# EasyEDA schematic SCH_Sherap_2021-11-23.json
TITLE: Arduino Shield Board; REV: 1.0; Date: 2021-10-27; Sheet: 1/1; Drawn By: Sherap; Company: Chitkara University
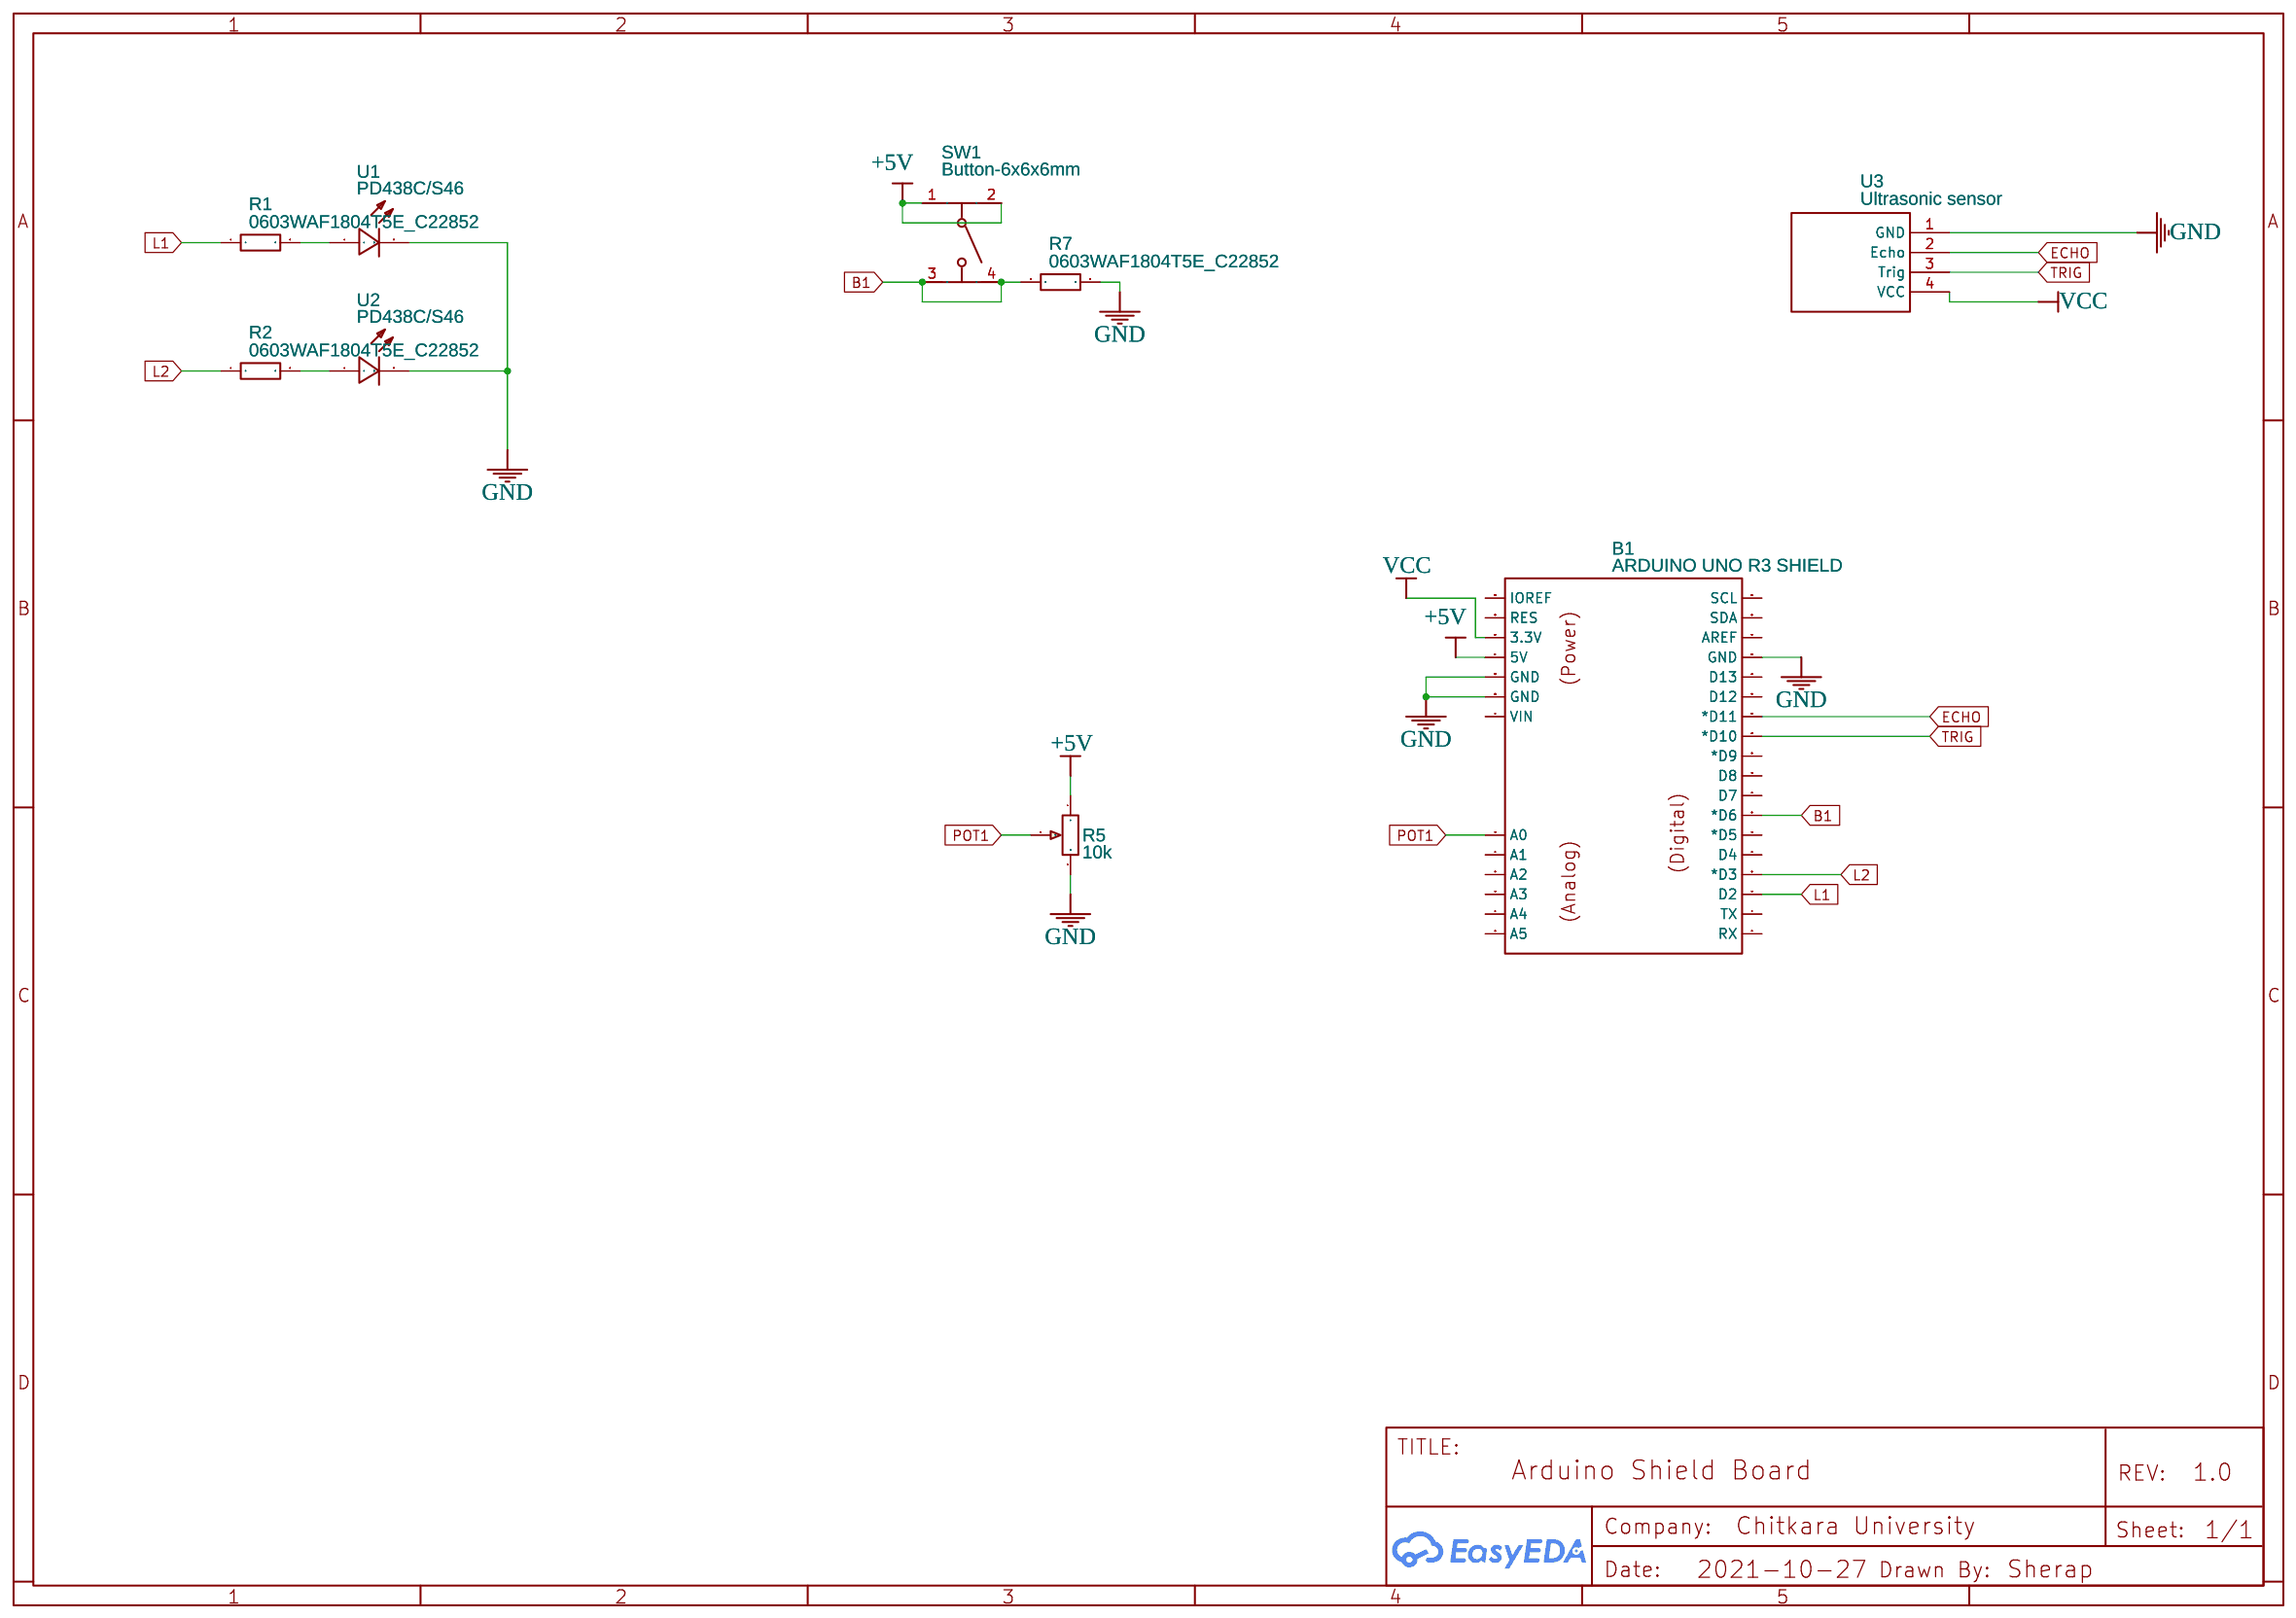
[diagram p0: schematic sheet]

## Parts
B1  ARDUINO UNO R3 SHIELD  [PKG-ARDUINO-UNO-R3-SHIELD]
R1  0603WAF1804T5E_C22852  [R0603]
R2  0603WAF1804T5E_C22852  [R0603]
R5  10k  [AS488DS3-SDF5]
R7  0603WAF1804T5E_C22852  [R0603]
SW1  Button-6x6x6mm  [SW-TH_4P-L6.0-W6.0-P4.50-LS6.1]
U1  PD438C/S46  [LED-TH_BD4.8-P2.54-FD]
U2  PD438C/S46  [LED-TH_BD4.8-P2.54-FD]
U3  Ultrasonic sensor  [ULTRASONIC SENSOR]

## Library data of the parts
B1 = ARDUINO UNO R3 SHIELD: Manufacturer: ?; Manufacturer Part: ?; Link: ?; Contributor: rgonzalez23
R1 R2 R7 = 0603WAF1804T5E_C22852: Supplier Part: C22852; Supplier: LCSC; Manufacturer: UniOhm; Manufacturer Part: 0603WAF1804T5E; JLCPCB Part Class: Extended Part
R5 = 3362F-1-103LF: Supplier: Digi-Key; Manufacturer: Panasonic Electronic Components; Supplier Part: 3362F-1-103LF-ND
SW1 = Button-6x6x6mm: Supplier Part: C71836; Supplier: LCSC; Manufacturer: BBJ; Manufacturer Part: Switch,6*6*6Plastic head,260G, 0.25mm,Straight line
U1 U2 = PD438C/S46: Supplier: LCSC; Manufacturer: EVERLIGHT; Contributor: LCSC; Supplier Part: C146238; JLCPCB Part Class: Extended Part
U3 = Ultrasonic sensor: Contributor: mohdazharsm

## Nets
+5V: B1.5V R5.1 SW1.1 SW1.2
GND: B1.GND@0(GND) B1.GND@1(GND) B1.GND@2(GND) R5.3 R7.2 U1.2(C) U2.2(C) U3.1(GND)
VCC: B1.3.3V U3.4(VCC)
B1: B1.D6(*D6) R7.1 SW1.3 SW1.4
ECHO: B1.D11(*D11) U3.2(Echo)
L1: B1.D2 R1.1
L2: B1.D3(*D3) R2.1
POT1: B1.A0 R5.2
TRIG: B1.D10(*D10) U3.3(Trig)
Net-(R1-2): R1.2 U1.1(A)
Net-(R2-2): R2.2 U2.1(A)

Not connected (* = marked no-connect by the designer): B1 A1 A2 A3 A4 A5 AREF D4 D5(*D5) D7 D8 D9(*D9) D12 D13 IOREF RES RX SCL SDA TX VIN
